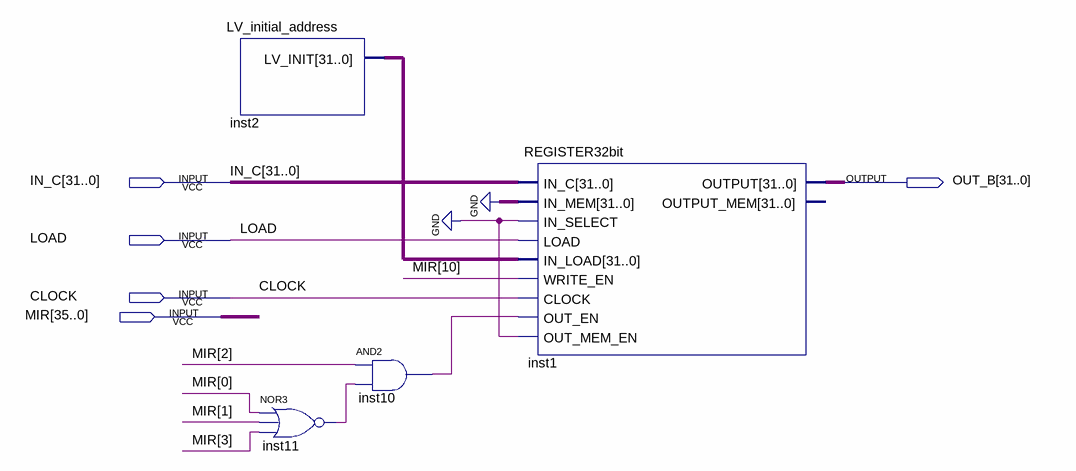
[diagram p0: schematic sheet]
// Quartus schematic SP.bdf as structural Verilog: 4 symbols, 5 pins
module SP (
  input  [31:0] IN_C,
  input  LOAD,
  input  CLOCK,
  input  [35:0] MIR,
  output [31:0] OUT_B
);

  wire inst10_out, inst11_out;
  wire [31:0] inst2_lv_init;

  LV_initial_address inst2 (.LV_INIT(inst2_lv_init));
  nor inst11 (inst11_out, MIR[0], MIR[1], MIR[3]);
  and inst10 (inst10_out, MIR[2], inst11_out);
  REGISTER32bit inst1 (
    .IN_C(IN_C), .IN_MEM({32{1'b0}}), .IN_SELECT(1'b0), .LOAD(LOAD), .IN_LOAD(inst2_lv_init),
    .WRITE_EN(MIR[10]), .CLOCK(CLOCK), .OUT_EN(inst10_out), .OUT_MEM_EN(1'b0), .OUTPUT(OUT_B));  // open: OUTPUT_MEM
endmodule
